# Altium schematic sheet Power-Supplies.SchDoc
size A2; Organization: Altium Limited; Address1: L3, 12a Rodborough Rd; Address2: Frenchs Forest; Address3: NSW; Address4: Australia 2086
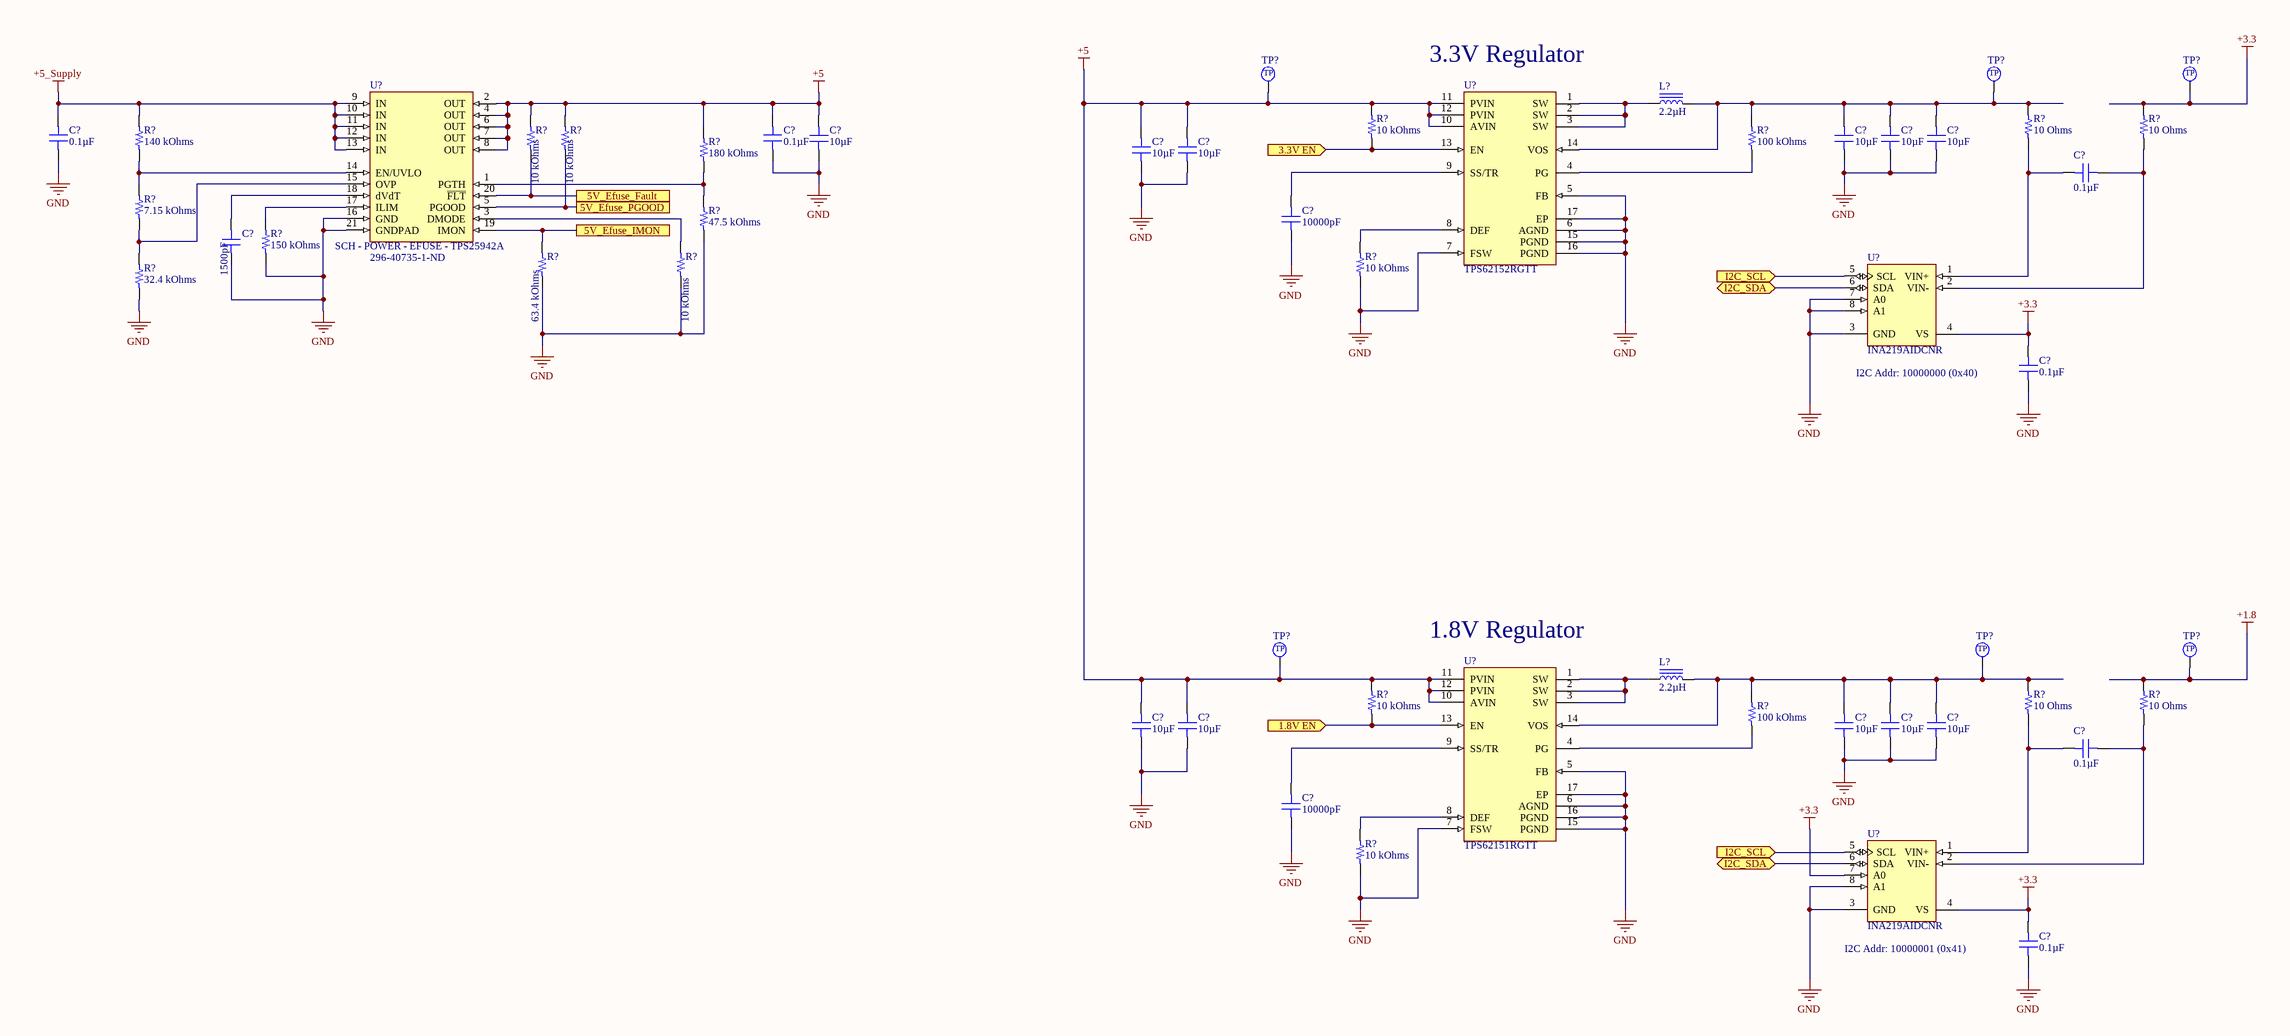
[diagram p0: Power-Supplies.SchDoc]

## Parts
(Parts that share a designator on the sheet are numbered #1, #2 ... from top to bottom, then left to right.)
C?#1  0.1µF  [CAP 0603_1608]
C?#2  0.1µF  [CAP 0603_1608]
C?#3  10µF  [CAP 0805_2012]
C?#4  10µF  [CAP 0805_2012]
C?#5  10µF  [CAP 0805_2012]
C?#6  10µF  [CAP 0805_2012]
C?#7  10µF  [CAP 0805_2012]
C?#8  10µF  [CAP 0805_2012]
C?#9  0.1µF  [CAP 0603_1608]
C?#10  10000pF  [CAP 0603_1608]
C?#11  1500pF  [CAP 0603_1608]
C?#12  0.1µF  [CAP 0603_1608]
C?#13  10µF  [CAP 0805_2012]
C?#14  10µF  [CAP 0805_2012]
C?#15  10µF  [CAP 0805_2012]
C?#16  10µF  [CAP 0805_2012]
C?#17  10µF  [CAP 0805_2012]
C?#18  0.1µF  [CAP 0603_1608]
C?#19  10000pF  [CAP 0603_1608]
C?#20  0.1µF  [CAP 0603_1608]
L?#1  2.2µH  [BOURNS SRN4018]
L?#2  2.2µH  [BOURNS SRN4018]
R?#1  10 kOhms  [RES 0603_1608]
R?#2  10 Ohms  [RES 0603_1608]
R?#3  10 Ohms  [RES 0603_1608]
R?#4  140 kOhms  [RES 0603_1608]
R?#5  10 kOhms  [RES 0603_1608]
R?#6  10 kOhms  [RES 0603_1608]
R?#7  100 kOhms  [RES 0603_1608]
R?#8  180 kOhms  [RES 0603_1608]
R?#9  7.15 kOhms  [RES 0603_1608]
R?#10  47.5 kOhms  [RES 0603_1608]
R?#11  150 kOhms  [RES 0603_1608]
R?#12  63.4 kOhms  [RES 0603_1608]
R?#13  10 kOhms  [RES 0603_1608]
R?#14  10 kOhms  [RES 0603_1608]
R?#15  32.4 kOhms  [RES 0603_1608]
R?#16  10 kOhms  [RES 0603_1608]
R?#17  10 Ohms  [RES 0603_1608]
R?#18  10 Ohms  [RES 0603_1608]
R?#19  100 kOhms  [RES 0603_1608]
R?#20  10 kOhms  [RES 0603_1608]
TP?#1  2.5mm_SMD_TestPoint  [2.5mm TestPoint]  (value not drawn)
TP?#2  2.5mm_SMD_TestPoint  [2.5mm TestPoint]  (value not drawn)
TP?#3  2.5mm_SMD_TestPoint  [2.5mm TestPoint]  (value not drawn)
TP?#4  2.5mm_SMD_TestPoint  [2.5mm TestPoint]  (value not drawn)
TP?#5  2.5mm_SMD_TestPoint  [2.5mm TestPoint]  (value not drawn)
TP?#6  2.5mm_SMD_TestPoint  [2.5mm TestPoint]  (value not drawn)
U?#1  TPS62152RGTT  [RGT0016C_V]
U?#2  SCH - POWER - EFUSE - TPS25942A  Supplier Part Number 1: 296-40735-1-ND  [PCB - LEADLESS - QFN - TI 20-WQFN]
U?#3  INA219AIDCNR  [DCN0008A_M]
U?#4  TPS62151RGTT  [RGT0016C_V]
U?#5  INA219AIDCNR  [DCN0008A_M]

## Ports
1.8V EN (in), 3.3V EN (in), 5V_Efuse_Fault, 5V_Efuse_IMON, 5V_Efuse_PGOOD, I2C_SCL (in), I2C_SDA (bidir)

## Nets
+1.8: R?#18.2 TP?#6.1
+3.3: C?#12.2 C?#20.2 R?#3.2 TP?#3.1 U?#3.4(VS) U?#5.4(VS) U?#5.7(A0)
+5: C?#2.2 C?#3.2 C?#7.2 C?#8.2 C?#13.2 C?#14.2 R?#1.2 R?#5.2 R?#6.2 R?#8.2 R?#16.2 TP?#1.1 TP?#4.1 U?#1.10(AVIN) U?#1.11(PVIN) U?#1.12(PVIN) U?#2.2(OUT) U?#2.4(OUT) U?#2.6(OUT) U?#2.7(OUT) U?#2.8(OUT) U?#4.10(AVIN) U?#4.11(PVIN) U?#4.12(PVIN)
+5_Supply: C?#1.2 R?#4.2 U?#2.9(IN) U?#2.10(IN) U?#2.11(IN) U?#2.12(IN) U?#2.13(IN)
GND: C?#1.1 C?#2.1 C?#3.1 C?#4.1 C?#5.1 C?#6.1 C?#7.1 C?#8.1 C?#10.1 C?#11.1 C?#12.1 C?#13.1 C?#14.1 C?#15.1 C?#16.1 C?#17.1 C?#19.1 C?#20.1 R?#10.1 R?#11.1 R?#12.1 R?#13.1 R?#14.1 R?#15.1 R?#20.1 U?#1.5(FB) U?#1.6(AGND) U?#1.7(FSW) U?#1.15(PGND) U?#1.16(PGND) U?#1.17(EP) U?#2.16(GND) U?#2.21(GNDPAD) U?#3.3(GND) U?#3.7(A0) U?#3.8(A1) U?#4.5(FB) U?#4.6(AGND) U?#4.7(FSW) U?#4.15(PGND) U?#4.16(PGND) U?#4.17(EP) U?#5.3(GND) U?#5.8(A1)
1.8V EN: R?#16.1 U?#4.13(EN) ; port 1.8V EN
3.3V EN: R?#1.1 U?#1.13(EN) ; port 3.3V EN
5V_Efuse_Fault: R?#5.1 U?#2.20(~{FLT}) ; port 5V_Efuse_Fault
5V_Efuse_IMON: R?#12.2 U?#2.19(IMON) ; port 5V_Efuse_IMON
5V_Efuse_PGOOD: R?#6.1 U?#2.5(PGOOD) ; port 5V_Efuse_PGOOD
I2C_SCL: U?#3.5(SCL) U?#5.5(SCL) ; port I2C_SCL
I2C_SDA: U?#3.6(SDA) U?#5.6(SDA) ; port I2C_SDA
NetC?#4_2: C?#4.2 C?#5.2 C?#6.2 L?#1.2 R?#2.2 R?#7.2 TP?#2.1 U?#1.14(VOS)
NetC?#9_1: C?#9.1 R?#3.1 U?#3.2(VIN-)
NetC?#9_2: C?#9.2 R?#2.1 U?#3.1(VIN+)
NetC?#10_2: C?#10.2 U?#1.9(SS/TR)
NetC?#11_2: C?#11.2 U?#2.18(dVdT)
NetC?#15_2: C?#15.2 C?#16.2 C?#17.2 L?#2.2 R?#17.2 R?#19.2 TP?#5.1 U?#4.14(VOS)
NetC?#18_1: C?#18.1 R?#18.1 U?#5.2(VIN-)
NetC?#18_2: C?#18.2 R?#17.1 U?#5.1(VIN+)
NetC?#19_2: C?#19.2 U?#4.9(SS/TR)
NetL?#1_1: L?#1.1 U?#1.1(SW) U?#1.2(SW) U?#1.3(SW)
NetL?#2_1: L?#2.1 U?#4.1(SW) U?#4.2(SW) U?#4.3(SW)
NetR?#4_1: R?#4.1 R?#9.2 U?#2.14(EN/UVLO)
NetR?#7_1: R?#7.1 U?#1.4(PG)
NetR?#8_1: R?#8.1 R?#10.2 U?#2.1(PGTH)
NetR?#9_1: R?#9.1 R?#15.2 U?#2.15(OVP)
NetR?#11_2: R?#11.2 U?#2.17(ILIM)
NetR?#13_2: R?#13.2 U?#2.3(DMODE)
NetR?#14_2: R?#14.2 U?#1.8(DEF)
NetR?#19_1: R?#19.1 U?#4.4(PG)
NetR?#20_2: R?#20.2 U?#4.8(DEF)

## Notes on the sheet
- (near U?#1) 3.3V Regulator
- I2C Addr: 10000000 (0x40)
- (near U?#4) 1.8V Regulator
- I2C Addr: 10000001 (0x41)
- Title
- Size:
- Date:
- File:
- A2
- Number:
- Time:
- Revision:
- Sheet
- of
- (in symbol 2.5mm_SMD_TestPoint) TP

## Library data of the parts
C?#1 C?#2 C?#9 C?#12 C?#18 C?#20 = CL10B104KA8WPNC: CAP CER 0.1UF 25V X7R 0603; Manufacturer: Samsung Electro-Mechanics; Tolerance: ±10%; Part Number: CL10B104KA8WPNC; Value: 0.1µF; Applications: Automotive; Capacitance: 0.1µF; ComponentLink1Description: Datasheet; ComponentLink1URL: http://www.samsungsem.com/kr/support/product-search/mlcc/CL10B104KA8WPNC.jsp; ComponentLink2Description: DigiKey Link; ComponentLink2URL: http://digikey.com/product-detail/en/samsung-electro-mechanics/CL10B104KA8WPNC/1276-6717-1-ND/5961576; Device Package: 0603 (1608 Metric); Features: Open Mode; LastUpdated: 9/2/2020 1:03:30 AM; Lifecycle Status: Active; Minimum Order: 1; Mounting Type: Surface Mount, MLCC; Operating Temperature: -55°C ~ 125°C; Package / Case: 0603 (1608 Metric); Packaging: TapeAndReel; PartId: 5631; Part Status: Active; Price: 0.02; Ratings: AEC-Q200; Series: CL; Size / Dimension: 0.063" L x 0.031" W (1.60mm x 0.80mm); Supplier 1: DigiKey; Supplier Part Number 1: 1276-6717-1-ND; Temperature Coefficient: X7R; Thickness (Max): 0.035" (0.90mm); Voltage - Rated: 25V
C?#3-C?#8 C?#13-C?#17 = CC0805KKX5R7BB106: CAP CER 10UF 16V X5R 0805; Manufacturer: Yageo; Tolerance: ±10%; Part Number: CC0805KKX5R7BB106; Value: 10µF; Applications: General Purpose; Capacitance: 10µF; ComponentLink1Description: Datasheet; ComponentLink1URL: https://www.yageo.com/upload/media/product/productsearch/datasheet/mlcc/UPY-GPHC_X5R_4V-to-50V_25.pdf; ComponentLink2Description: DigiKey Link; ComponentLink2URL: http://digikey.com/product-detail/en/yageo/CC0805KKX5R7BB106/311-1865-1-ND/5195767; Device Package: 0805 (2012 Metric); LastUpdated: 9/2/2020 1:04:30 AM; Lifecycle Status: Active; Minimum Order: 1; Mounting Type: Surface Mount, MLCC; Operating Temperature: -55°C ~ 85°C; Package / Case: 0805 (2012 Metric); Packaging: TapeAndReel; PartId: 8867; Part Status: Active; Price: 0.09; Series: CC; Size / Dimension: 0.079" L x 0.049" W (2.00mm x 1.25mm); Supplier 1: DigiKey; Supplier Part Number 1: 311-1865-1-ND; Temperature Coefficient: X5R; Thickness (Max): 0.057" (1.45mm); Voltage - Rated: 16V
C?#10 C?#19 = C0603S103K4RACTU: CAP CER 10000PF 16V X7R 0603; Manufacturer: KEMET; Tolerance: ±10%; Part Number: C0603S103K4RACTU; Value: 10000pF; Applications: Boardflex Sensitive; Capacitance: 10000pF; ComponentLink1Description: Datasheet; ComponentLink1URL: https://api.kemet.com/component-edge/download/datasheet/C0603S103K4RACTU.pdf; ComponentLink2Description: DigiKey Link; ComponentLink2URL: http://digikey.com/product-detail/en/kemet/C0603S103K4RACTU/399-9135-1-ND/3522653; Device Package: 0603 (1608 Metric); Features: Floating Electrode; LastUpdated: 9/2/2020 1:03:34 AM; Lifecycle Status: Active; Minimum Order: 1; Mounting Type: Surface Mount, MLCC; Operating Temperature: -55°C ~ 125°C; Package / Case: 0603 (1608 Metric); Packaging: TapeAndReel; PartId: 3312; Part Status: Active; Price: 0.07; Series: SMD Comm X7R FE; Size / Dimension: 0.063" L x 0.031" W (1.60mm x 0.80mm); Supplier 1: DigiKey; Supplier Part Number 1: 399-9135-1-ND; Temperature Coefficient: X7R; Thickness (Max): 0.034" (0.87mm); Voltage - Rated: 16V
C?#11 = CC0603JRX7R8BB152: CAP CER 1500PF 25V X7R 0603; Manufacturer: Yageo; Tolerance: ±5%; Part Number: CC0603JRX7R8BB152; Value: 1500pF; Applications: General Purpose; Capacitance: 1500pF; ComponentLink1Description: Datasheet; ComponentLink1URL: https://www.yageo.com/upload/media/product/productsearch/datasheet/mlcc/UPY-GPHC_X7R_6.3V-to-50V_18.pdf; ComponentLink2Description: DigiKey Link; ComponentLink2URL: http://digikey.com/product-detail/en/yageo/CC0603JRX7R8BB152/311-3996-1-ND/8025085; Device Package: 0603 (1608 Metric); LastUpdated: 9/2/2020 1:03:18 AM; Lifecycle Status: Active; Minimum Order: 1; Mounting Type: Surface Mount, MLCC; Operating Temperature: -55°C ~ 125°C; Package / Case: 0603 (1608 Metric); Packaging: TapeAndReel; PartId: 12307; Part Status: Active; Price: 0.02; Series: CC; Size / Dimension: 0.063" L x 0.031" W (1.60mm x 0.80mm); Supplier 1: DigiKey; Supplier Part Number 1: 311-3996-1-ND; Temperature Coefficient: X7R; Thickness (Max): 0.035" (0.90mm); Voltage - Rated: 25V
L?#1 L?#2 = SRN4018-2R2M: FIXED IND 2.2UH 2.9A 44 MOHM SMD; Manufacturer: Bourns Inc.; Current - Saturation: 3A; DC Resistance (DCR): 44mOhm Max; Frequency - Self Resonant: 60MHz; Inductance Frequency - Test: 100kHz; Material - Core: Ferrite; Q @ Freq: 9 @ 7.96MHz; Shielding: Semi-Shielded; Tolerance: ±20%; Type: Wirewound; Part Number: SRN4018-2R2M; ComponentLink1Description: Datasheet; ComponentLink1URL: https://www.bourns.com/docs/Product-Datasheets/SRN4018.pdf; ComponentLink2Description: DigiKey Link; ComponentLink2URL: http://digikey.com/product-detail/en/bourns-inc/SRN4018-2R2M/SRN4018-2R2MCT-ND/3821517; Current Rating (Amps): 2.9A; Device Package: Nonstandard; Height - Seated (Max): 0.071" (1.80mm); Inductance: 2.2µH; LastUpdated: 9/2/2020 1:30:23 AM; Lifecycle Status: Active; Minimum Order: 1; Mounting Type: Surface Mount; Operating Temperature: -40°C ~ 125°C; Package / Case: Nonstandard; Packaging: TapeAndReel; PartId: 3660; Part Status: Active; Price: 0.16; Series: SRN4018; Size / Dimension: 0.157" L x 0.157" W (4.00mm x 4.00mm); Supplier 1: DigiKey; Supplier Part Number 1: SRN4018-2R2MCT-ND; Value: 2.2µH
R?#1 R?#5 R?#6 R?#13 R?#14 R?#16 R?#20 = RMCF0603JT10K0: RES 10K OHM 5% 1/10W 0603; Manufacturer: Stackpole Electronics Inc; Power (Watts): 0.1W, 1/10W; Temperature Coefficient: ±200ppm/°C; Part Number: RMCF0603JT10K0; Value: 10 kOhms; ComponentLink1Description: Datasheet; ComponentLink1URL: https://www.seielect.com/catalog/sei-packaging.pdf; ComponentLink2Description: DigiKey Link; ComponentLink2URL: http://digikey.com/product-detail/en/stackpole-electronics-inc/RMCF0603JT10K0/RMCF0603JT10K0CT-ND/1943191; Composition: Thick Film; Device Package: 0603 (1608 Metric); Features: Automotive AEC-Q200; Height - Seated (Max): 0.022" (0.55mm); LastUpdated: 8/30/2020 8:48:45 PM; Lifecycle Status: Active; Minimum Order: 1; Number of Terminations: 2; Operating Temperature: -55°C ~ 155°C; Package / Case: 0603 (1608 Metric); Packaging: CutTape; PartId: 25659; Part Status: Active; Price: 0.10; Ratings: AEC-Q200; Resistance: 10 kOhms; Series: RMCF; Size / Dimension: 0.061" L x 0.031" W (1.55mm x 0.80mm); Supplier 1: DigiKey; Supplier Part Number 1: RMCF0603JT10K0CT-ND; Supplier Device Package: 0603; Tolerance: ±5%
R?#2 R?#3 R?#17 R?#18 = CRGCQ0603F10R: CRGCQ 0603 10R 1%; Manufacturer: TE Connectivity Passive Product; Power (Watts): 0.1W, 1/10W; Temperature Coefficient: ±400ppm/°C; Part Number: CRGCQ0603F10R; Value: 10 Ohms; ComponentLink1Description: Datasheet; ComponentLink1URL: https://www.te.com/commerce/DocumentDelivery/DDEController?Action=srchrtrv&DocNm=1773204-3&DocType=DS&DocLang=English; ComponentLink2Description: DigiKey Link; ComponentLink2URL: http://digikey.com/product-detail/en/te-connectivity-passive-product/CRGCQ0603F10R/A129664CT-ND/8577496; Composition: Thick Film; Device Package: 0603 (1608 Metric); Features: Automotive AEC-Q200, Moisture Resistant; Height - Seated (Max): 0.022" (0.55mm); LastUpdated: 9/2/2020 1:09:39 AM; Lifecycle Status: Active; Minimum Order: 1; Number of Terminations: 2; Operating Temperature: -55°C ~ 155°C; Package / Case: 0603 (1608 Metric); Packaging: CutTape; PartId: 23975; Part Status: Active; Price: 0.10; Ratings: AEC-Q200; Resistance: 10 Ohms; Series: CRGCQ; Size / Dimension: 0.063" L x 0.031" W (1.60mm x 0.80mm); Supplier 1: DigiKey; Supplier Part Number 1: A129664CT-ND; Supplier Device Package: 0603; Tolerance: ±1%
R?#4 = RT0603BRE07140KL: RES SMD 140K OHM 0.1% 1/10W 0603; Manufacturer: Yageo; Power (Watts): 0.1W, 1/10W; Temperature Coefficient: ±50ppm/°C; Part Number: RT0603BRE07140KL; Value: 140 kOhms; ComponentLink1Description: Datasheet; ComponentLink1URL: https://www.yageo.com/upload/media/product/productsearch/datasheet/rchip/PYu-RT_1-to-0.01_RoHS_L_11.pdf; ComponentLink2Description: DigiKey Link; ComponentLink2URL: http://digikey.com/product-detail/en/yageo/RT0603BRE07140KL/YAG4626CT-ND/6616782; Composition: Thin Film; Device Package: 0603 (1608 Metric); Height - Seated (Max): 0.022" (0.55mm); LastUpdated: 9/2/2020 1:09:47 AM; Lifecycle Status: Active; Minimum Order: 1; Number of Terminations: 2; Operating Temperature: -55°C ~ 155°C; Package / Case: 0603 (1608 Metric); Packaging: TapeAndReel; PartId: 22168; Part Status: Active; Price: 0.05; Resistance: 140 kOhms; Series: RT; Size / Dimension: 0.063" L x 0.031" W (1.60mm x 0.80mm); Supplier 1: DigiKey; Supplier Part Number 1: YAG4626CT-ND; Supplier Device Package: 0603; Tolerance: ±0.1%
R?#7 R?#19 = RC0603JR-10100KL: RES SMD 100K OHM 5% 1/10W 0603; Manufacturer: Yageo; Power (Watts): 0.1W, 1/10W; Temperature Coefficient: ±100ppm/°C; Part Number: RC0603JR-10100KL; Value: 100 kOhms; ComponentLink1Description: Datasheet; ComponentLink1URL: https://www.yageo.com/upload/media/product/productsearch/datasheet/rchip/PYu-RC_Group_51_RoHS_L_10.pdf; ComponentLink2Description: DigiKey Link; ComponentLink2URL: http://digikey.com/product-detail/en/yageo/RC0603JR-10100KL/YAG2294CT-ND/5252408; Composition: Thick Film; Device Package: 0603 (1608 Metric); Features: Moisture Resistant; Height - Seated (Max): 0.022" (0.55mm); LastUpdated: 9/2/2020 1:10:22 AM; Lifecycle Status: Active; Minimum Order: 1; Number of Terminations: 2; Operating Temperature: -55°C ~ 155°C; Package / Case: 0603 (1608 Metric); Packaging: CutTape; PartId: 6071; Part Status: Active; Price: 0.10; Resistance: 100 kOhms; Series: RC; Size / Dimension: 0.063" L x 0.031" W (1.60mm x 0.80mm); Supplier 1: DigiKey; Supplier Part Number 1: YAG2294CT-ND; Supplier Device Package: 0603; Tolerance: ±5%
R?#8 = RMCF0603FT180K: RES 180K OHM 1% 1/10W 0603; Manufacturer: Stackpole Electronics Inc; Power (Watts): 0.1W, 1/10W; Temperature Coefficient: ±100ppm/°C; Part Number: RMCF0603FT180K; Value: 180 kOhms; ComponentLink1Description: Datasheet; ComponentLink1URL: https://www.seielect.com/catalog/sei-rmcf_rmcp.pdf; ComponentLink2Description: DigiKey Link; ComponentLink2URL: http://digikey.com/product-detail/en/stackpole-electronics-inc/RMCF0603FT180K/RMCF0603FT180KCT-ND/5049744; Composition: Thick Film; Device Package: 0603 (1608 Metric); Features: Automotive AEC-Q200; Height - Seated (Max): 0.022" (0.55mm); LastUpdated: 9/2/2020 1:10:00 AM; Lifecycle Status: Active; Minimum Order: 1; Number of Terminations: 2; Operating Temperature: -55°C ~ 155°C; Package / Case: 0603 (1608 Metric); Packaging: CutTape; PartId: 16499; Part Status: Active; Price: 0.10; Ratings: AEC-Q200; Resistance: 180 kOhms; Series: RMCF; Size / Dimension: 0.061" L x 0.031" W (1.55mm x 0.80mm); Supplier 1: DigiKey; Supplier Part Number 1: RMCF0603FT180KCT-ND; Supplier Device Package: 0603; Tolerance: ±1%
R?#9 = ERJ-PB3B7151V: RES SMD 7.15K OHM 0.1% 1/5W 0603; Manufacturer: Panasonic Electronic Components; Power (Watts): 0.2W, 1/5W; Temperature Coefficient: ±50ppm/°C; Part Number: ERJ-PB3B7151V; Value: 7.15 kOhms; ComponentLink1Description: Datasheet; ComponentLink1URL: https://industrial.panasonic.com/cdbs/www-data/pdf/RDM0000/AOA0000C328.pdf; ComponentLink2Description: DigiKey Link; ComponentLink2URL: http://digikey.com/product-detail/en/panasonic-electronic-components/ERJ-PB3B7151V/P20070CT-ND/6214325; Composition: Thick Film; Device Package: 0603 (1608 Metric); Features: Automotive AEC-Q200, Pulse Withstanding; Height - Seated (Max): 0.022" (0.55mm); LastUpdated: 9/2/2020 1:10:22 AM; Lifecycle Status: Active; Minimum Order: 1; Number of Terminations: 2; Operating Temperature: -55°C ~ 155°C; Package / Case: 0603 (1608 Metric); Packaging: TapeAndReel; PartId: 6380; Part Status: Active; Price: 0.03; Ratings: AEC-Q200; Resistance: 7.15 kOhms; Series: ERJ; Size / Dimension: 0.063" L x 0.031" W (1.60mm x 0.80mm); Supplier 1: DigiKey; Supplier Part Number 1: P20070CT-ND; Supplier Device Package: 0603; Tolerance: ±0.1%
R?#10 = RMCF0603FG47K5: RES 47.5K OHM 1% 1/10W 0603; Manufacturer: Stackpole Electronics Inc; Power (Watts): 0.1W, 1/10W; Temperature Coefficient: ±100ppm/°C; Part Number: RMCF0603FG47K5; Value: 47.5 kOhms; ComponentLink1Description: Datasheet; ComponentLink1URL: https://www.seielect.com/catalog/sei-packaging.pdf; ComponentLink2Description: DigiKey Link; ComponentLink2URL: http://digikey.com/product-detail/en/stackpole-electronics-inc/RMCF0603FG47K5/RMCF0603FG47K5CT-ND/4425046; Composition: Thick Film; Device Package: 0603 (1608 Metric); Features: Automotive AEC-Q200; Height - Seated (Max): 0.022" (0.55mm); LastUpdated: 9/2/2020 1:09:32 AM; Lifecycle Status: Active; Minimum Order: 1; Number of Terminations: 2; Operating Temperature: -55°C ~ 155°C; Package / Case: 0603 (1608 Metric); Packaging: CutTape; PartId: 25458; Part Status: Active; Price: 0.10; Ratings: AEC-Q200; Resistance: 47.5 kOhms; Series: RMCF; Size / Dimension: 0.061" L x 0.031" W (1.55mm x 0.80mm); Supplier 1: DigiKey; Supplier Part Number 1: RMCF0603FG47K5CT-ND; Supplier Device Package: 0603; Tolerance: ±1%
R?#11 = RMCF0603FG150K: RES 150K OHM 1% 1/10W 0603; Manufacturer: Stackpole Electronics Inc; Power (Watts): 0.1W, 1/10W; Temperature Coefficient: ±100ppm/°C; Part Number: RMCF0603FG150K; Value: 150 kOhms; ComponentLink1Description: Datasheet; ComponentLink1URL: https://www.seielect.com/catalog/sei-rmcf_rmcp.pdf; ComponentLink2Description: DigiKey Link; ComponentLink2URL: http://digikey.com/product-detail/en/stackpole-electronics-inc/RMCF0603FG150K/RMCF0603FG150KCT-ND/4425034; Composition: Thick Film; Device Package: 0603 (1608 Metric); Features: Automotive AEC-Q200; Height - Seated (Max): 0.022" (0.55mm); LastUpdated: 9/2/2020 1:10:05 AM; Lifecycle Status: Active; Minimum Order: 1; Number of Terminations: 2; Operating Temperature: -55°C ~ 155°C; Package / Case: 0603 (1608 Metric); Packaging: CutTape; PartId: 13982; Part Status: Active; Price: 0.10; Ratings: AEC-Q200; Resistance: 150 kOhms; Series: RMCF; Size / Dimension: 0.061" L x 0.031" W (1.55mm x 0.80mm); Supplier 1: DigiKey; Supplier Part Number 1: RMCF0603FG150KCT-ND; Supplier Device Package: 0603; Tolerance: ±1%
R?#12 = RMCF0603FT63K4: RES 63.4K OHM 1% 1/10W 0603; Manufacturer: Stackpole Electronics Inc; Power (Watts): 0.1W, 1/10W; Temperature Coefficient: ±100ppm/°C; Part Number: RMCF0603FT63K4; Value: 63.4 kOhms; ComponentLink1Description: Datasheet; ComponentLink1URL: https://www.seielect.com/catalog/sei-rmcf_rmcp.pdf; ComponentLink2Description: DigiKey Link; ComponentLink2URL: http://digikey.com/product-detail/en/stackpole-electronics-inc/RMCF0603FT63K4/RMCF0603FT63K4CT-ND/2418113; Composition: Thick Film; Device Package: 0603 (1608 Metric); Features: Automotive AEC-Q200; Height - Seated (Max): 0.022" (0.55mm); LastUpdated: 9/2/2020 1:10:16 AM; Lifecycle Status: Active; Minimum Order: 1; Number of Terminations: 2; Operating Temperature: -55°C ~ 155°C; Package / Case: 0603 (1608 Metric); Packaging: CutTape; PartId: 8895; Part Status: Active; Price: 0.10; Ratings: AEC-Q200; Resistance: 63.4 kOhms; Series: RMCF; Size / Dimension: 0.061" L x 0.031" W (1.55mm x 0.80mm); Supplier 1: DigiKey; Supplier Part Number 1: RMCF0603FT63K4CT-ND; Supplier Device Package: 0603; Tolerance: ±1%
R?#15 = ERJ-PB3B3242V: RES SMD 32.4K OHM 0.1% 1/5W 0603; Manufacturer: Panasonic Electronic Components; Power (Watts): 0.2W, 1/5W; Temperature Coefficient: ±50ppm/°C; Part Number: ERJ-PB3B3242V; Value: 32.4 kOhms; ComponentLink1Description: Datasheet; ComponentLink1URL: https://industrial.panasonic.com/cdbs/www-data/pdf/RDM0000/AOA0000C328.pdf; ComponentLink2Description: DigiKey Link; ComponentLink2URL: http://digikey.com/product-detail/en/panasonic-electronic-components/ERJ-PB3B3242V/P20142CT-ND/6214397; Composition: Thick Film; Device Package: 0603 (1608 Metric); Features: Automotive AEC-Q200, Pulse Withstanding; Height - Seated (Max): 0.022" (0.55mm); LastUpdated: 9/2/2020 1:10:06 AM; Lifecycle Status: Active; Minimum Order: 1; Number of Terminations: 2; Operating Temperature: -55°C ~ 155°C; Package / Case: 0603 (1608 Metric); Packaging: TapeAndReel; PartId: 13586; Part Status: Active; Price: 0.03; Ratings: AEC-Q200; Resistance: 32.4 kOhms; Series: ERJ; Size / Dimension: 0.063" L x 0.031" W (1.60mm x 0.80mm); Supplier 1: DigiKey; Supplier Part Number 1: P20142CT-ND; Supplier Device Package: 0603; Tolerance: ±0.1%
U?#1 = CMP-0323-00129-3: Buck Step Down Regulator with 3 to 17 V Input and 3.3 V Output, -40 to 85 degC, 16-Pin QFN (RGT), Green (RoHS & no Sb/Br); Manufacturer: Texas Instruments; Rating: Catalog; Duty Cycle(Max)(%): 100; Regulated Outputs(#): 1; Preset Vout(V): 3.3; Vin(Max)(V): 17; Switch Current Limit(Typ)(A): 1.7; SubFamily: Step-Down Regulator; Iq(Typ)(mA): 0.017; Vin(Min)(V): 3; Synchronous Rectification: TRUE; PackageVersion: revH, Oct-2011; ComponentLink2Description: Package Specification; Code_JEDEC: MO-220; ComponentLink1Description: Datasheet; PackageDescription: 16-Pin Plastic Quad Flat No-Lead, 3 x 3 mm Body, 0.5 mm Pitch, 1.7 x 1.7 mm Exposed Pad; Iout(Max)(A): 1; Eco-Plan: Green (RoHS & no Sb/Br); PartNumber: TPS62152RGTT; Vout(Max)(V): 3.3; Topology: Buck; ComponentLink3URL: Samples URL:http://www.ti.com/product/tps54611#samples; ComponentLink2URL: http://www.ti.com/litv/pdf/mpqf119g; ComponentLink3Description: URL Link1; ComponentLink1URL: http://www.ti.com/general/docs/lit/getliterature.tsp?genericPartNumber=TPS62152&fileType=pdf; Vout(Min)(V): 3.3; Mounting Technology: Surface Mount; DatasheetVersion: SLVSAL5; PackageReference: RGT0016C
U?#3 U?#5 = CMP-0704-00041-2: Zero-Drift, Bi-directional Current / Power Monitor, 3 to 5.5 V, -40 to 125 degC, 8-pin SOP (DCN8), Green (RoHS & no Sb/Br); Manufacturer: Texas Instruments; Input Offset (+/-)(Max)(uV): 100; Small-Signal Bandwidth(Typ)(MHz): 0.011; SubFamily: Current Shunt Monitor; Rating: Catalog; Quiescent Current (+/-)(Typ)(mA): 0.7; Vs(Max)(V): 5.5; Common Mode Range(Min)(V): 0; Vs(Min)(V): 3; Common Mode Range(Max)(V): 26; Gain(V/V): 1, 0.5, 0.25, 0.125; ComponentLink3URL: http://www.ti.com/lit/ml/mpds099c/mpds099c.pdf; ComponentLink2URL: http://www.ti.com/general/docs/lit/getliterature.tsp?genericPartNumber=INA219&fileType=pdf; PackageReference: DCN0008A; ComponentLink1URL: http://www.ti.com/; ComponentLink1Description: Manufacturer URL; Code_JEDEC: MO-178; CMRR(Min)(dB): 100; DatasheetVersion: SBOS448F; Mounting Technology: Surface Mount; ComponentLink3Description: Package Specification; PartNumber: INA219AIDCNR; PackageVersion: 4202106/D, 11/2009; Eco-Plan: Green (RoHS & no Sb/Br); ComponentLink2Description: Datasheet; PackageDescription: 8-Pin Plastic Small Outline, Body 1.6 x 2.9 mm, Pitch 0.65 mm
U?#4 = CMP-0323-00124-3: Buck Step Down Regulator with 3 to 17 V Input and 1.8 V Output, -40 to 85 degC, 16-Pin QFN (RGT), Green (RoHS & no Sb/Br); Manufacturer: Texas Instruments; Vin(Min)(V): 3; Duty Cycle(Max)(%): 90; SubFamily: Step-Down Regulator; Iq(Typ)(mA): 0.017; Regulated Outputs(#): 1; Vout(Max)(V): 1.8; Switch Current Limit(Typ)(A): 1.7; Synchronous Rectification: TRUE; Vin(Max)(V): 17; Rating: Catalog; ComponentLink2Description: Package Specification; ComponentLink2URL: http://www.ti.com/litv/pdf/mpqf119g; Code_JEDEC: MO-220; DatasheetVersion: SLVSAL5; Mounting Technology: Surface Mount; PartNumber: TPS62151RGTT; ComponentLink1Description: Datasheet; Eco-Plan: Green (RoHS & no Sb/Br); ComponentLink1URL: http://www.ti.com/general/docs/lit/getliterature.tsp?genericPartNumber=TPS62151&fileType=pdf; Iout(Max)(A): 1; PackageDescription: 16-Pin Plastic Quad Flat No-Lead, 3 x 3 mm Body, 0.5 mm Pitch, 1.7 x 1.7 mm Exposed Pad; ComponentLink3Description: URL Link1; Topology: Buck; ComponentLink3URL: Samples URL:http://www.ti.com/product/tps54611#samples; PackageVersion: revH, Oct-2011; Vout(Min)(V): 1.8; Preset Vout(V): 1.8; PackageReference: RGT0016C
U?#2 = SCH - POWER - EFUSE - TPS25942A: Supplier 1: Digi-Key